# Altium schematic sheet BL653u.SchDoc
size 292 x 193 mm; CompanyName: Politechnika Warszawska; Organization: EITI; Address1: Nowowiejska 15/19; Address2: 00-665 Warszawa; SheetNumber: 2; SheetTotal: 5; HTTPLink: www.pw.edu.pl
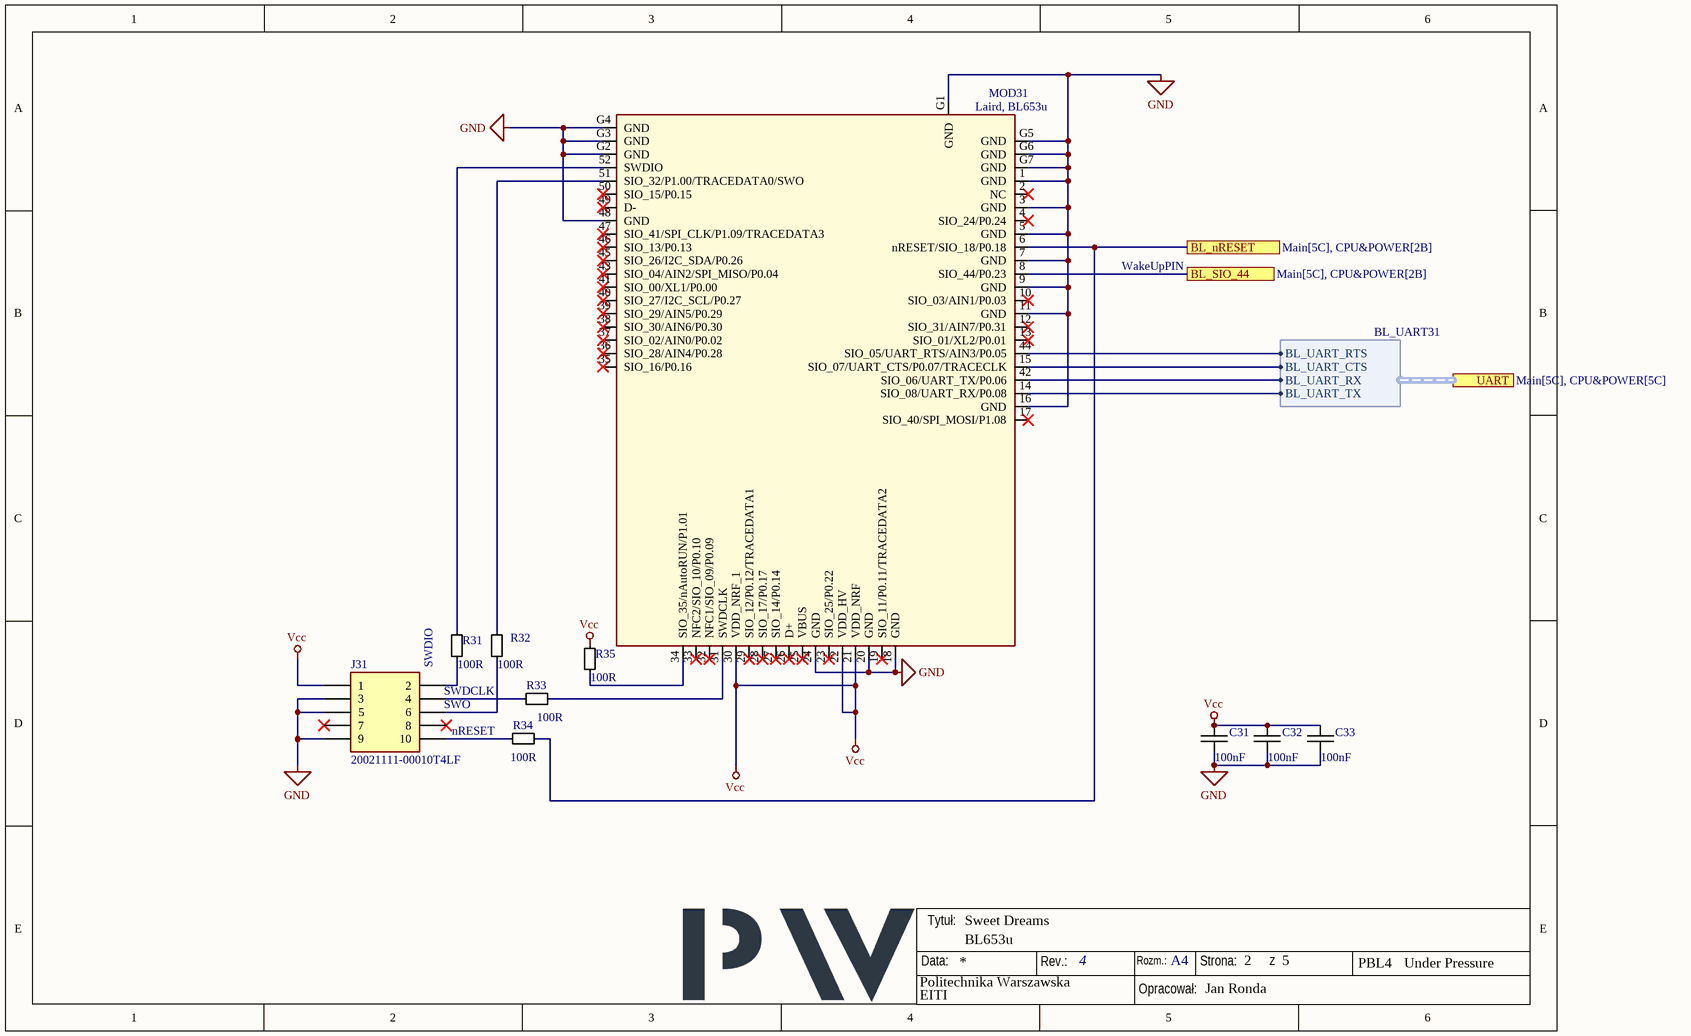
[diagram p0: BL653u.SchDoc]

## Parts
C31  100nF  [0402_CAP]
C32  100nF  [0402_CAP]
C33  100nF  [0402_CAP]
J31  20021111-00010T4LF  [HDRV10W41P127_2X5_635X343X575P_m]
MOD31  Laird, BL653u  [45300059C_m]
R31  100R  [0402_RES]
R32  100R  [0402_RES]
R33  100R  [0402_RES]
R34  100R  [0402_RES]
R35  100R  [0402_RES]

## Ports
BL_nRESET (see Main[5C], CPU&POWER[2B]), BL_SIO_44 (see Main[5C], CPU&POWER[2B]), UART (harness BL_UART31, see Main[5C], CPU&POWER[5C])

## Harnesses
BL_UART31: BL_UART_RTS, BL_UART_CTS, BL_UART_RX, BL_UART_TX

## Nets
GND: C31.2 C32.2 C33.2 J31.3 J31.5 J31.9 MOD31.1(GND) MOD31.3(GND) MOD31.5(GND) MOD31.7(GND) MOD31.9(GND) MOD31.11(GND) MOD31.16(GND) MOD31.18(GND) MOD31.20(GND) MOD31.24(GND) MOD31.48(GND) MOD31.G1(GND) MOD31.G2(GND) MOD31.G3(GND) MOD31.G4(GND) MOD31.G5(GND) MOD31.G6(GND) MOD31.G7(GND)
Vcc: C31.1 C32.1 C33.1 J31.1 MOD31.21(VDD_NRF) MOD31.22(VDD_HV) MOD31.30(VDD_NRF_1) R35.1
BL_nRESET: MOD31.6(nRESET/SIO_18/P0.18) R34.1 ; port BL_nRESET
BL_SIO_44: MOD31.8(SIO_44/P0.23) ; port BL_SIO_44
NetJ31_2: J31.2 R31.1
NetJ31_4: J31.4 R33.2
NetJ31_6: J31.6 R32.1
NetJ31_10: J31.10 R34.2
NetMOD31_14: MOD31.14(SIO_08/UART_RX/P0.08) ; port UART.BL_UART_TX
NetMOD31_15: MOD31.15(SIO_07/UART_CTS/P0.07/TRACECLK) ; port UART.BL_UART_CTS
NetMOD31_31: MOD31.31(SWDCLK) R33.1
NetMOD31_34: MOD31.34(SIO_35/nAutoRUN/P1.01) R35.2
NetMOD31_42: MOD31.42(SIO_06/UART_TX/P0.06) ; port UART.BL_UART_RX
NetMOD31_44: MOD31.44(SIO_05/UART_RTS/AIN3/P0.05) ; port UART.BL_UART_RTS
NetMOD31_51: MOD31.51(SIO_32/P1.00/TRACEDATA0/SWO) R32.2
NetMOD31_52: MOD31.52(SWDIO) R31.2

Not connected (* = marked no-connect by the designer): J31 7* 8*; MOD31 2(NC)* 4(SIO_24/P0.24)* 10(SIO_03/AIN1/P0.03)* 12(SIO_31/AIN7/P0.31)* 13(SIO_01/XL2/P0.01)* 17(SIO_40/SPI_MOSI/P1.08)* 19(SIO_11/P0.11/TRACEDATA2)* 23(SIO_25/P0.22___________)* 25(VBUS)* 26(D+)* 27(SIO_14/P0.14)* 28(SIO_17/P0.17)* 29(SIO_12/P0.12/TRACEDATA1)* 32(NFC1/SIO_09/P0.09)* 33(NFC2/SIO_10/P0.10)* 35(SIO_16/P0.16)* 36(SIO_28/AIN4/P0.28)* 37(SIO_02/AIN0/P0.02)* 38(SIO_30/AIN6/P0.30)* 39(SIO_29/AIN5/P0.29)* 40(SIO_27/I2C_SCL/P0.27)* 41(SIO_00/XL1/P0.00)* 43(SIO_04/AIN2/SPI_MISO/P0.04)* 45(SIO_26/I2C_SDA/P0.26)* 46(SIO_13/P0.13)* 47(SIO_41/SPI_CLK/P1.09/TRACEDATA3)* 49(D-)* 50(SIO_15/P0.15)*

## Notes on the sheet
- WakeUpPIN
- SWDIO
- (near J31) SWO
- SWDCLK
- nRESET
- Data:
- Tytuł:
- Sweet Dreams
- BL653u
- Rev.:
- 4
- Rozm.:
- A4
- Strona:
- z
- PBL4
- Under Pressure
- Opracował:
- Jan Ronda

## Library data of the parts
C31-C33 = Capacitor_1: Ceramic Capacitor; Parameter 1: 100nF
J31 = 20021111-00010T4LF: Connector; Manufacturer_Name: Amphenol Communications Solutions; Datasheet Link: https://cdn.amphenol-cs.com/media/wysiwyg/files/drawing/20021111.pdf; Height: 5.75mm; Manufacturer_Part_Number: 20021111-00010T4LF; Mouser Part Number: 649-221111-00010T4LF; Mouser Price/Stock: https://www.mouser.co.uk/ProductDetail/Amphenol-FCI/20021111-00010T4LF?qs=nwYJ12Fl9gR8B5xkaYs9gA%3D%3D; Arrow Part Number: 20021111-00010T4LF; Arrow Price/Stock: https://www.arrow.com/en/products/20021111-00010t4lf/amphenol-fci?region=europe
MOD31 = Laird, BL653u: BL653µ Integrated Antenna module, 453-00059; Substitutes Allowed: NO; Datasheet Link: https://connectivity-staging.s3.us-east-2.amazonaws.com/s3fs-public/2018-12/BL654%20Datasheet%20v1_6.pdf; Mounting: SMT; Operating Temperature: -40C~85C; Manufacturer Part Number: 453-00059; Footprint: Laird, Module, BL653u-SA; Manufacturer: Laird
R31-R35 = Resistor: Parameter 1: 100R